# Altium schematic sheet AET_mcu.SchDoc
size 594 x 420 mm; SheetNumber: 1; SheetTotal: 1; SheetSize: А2
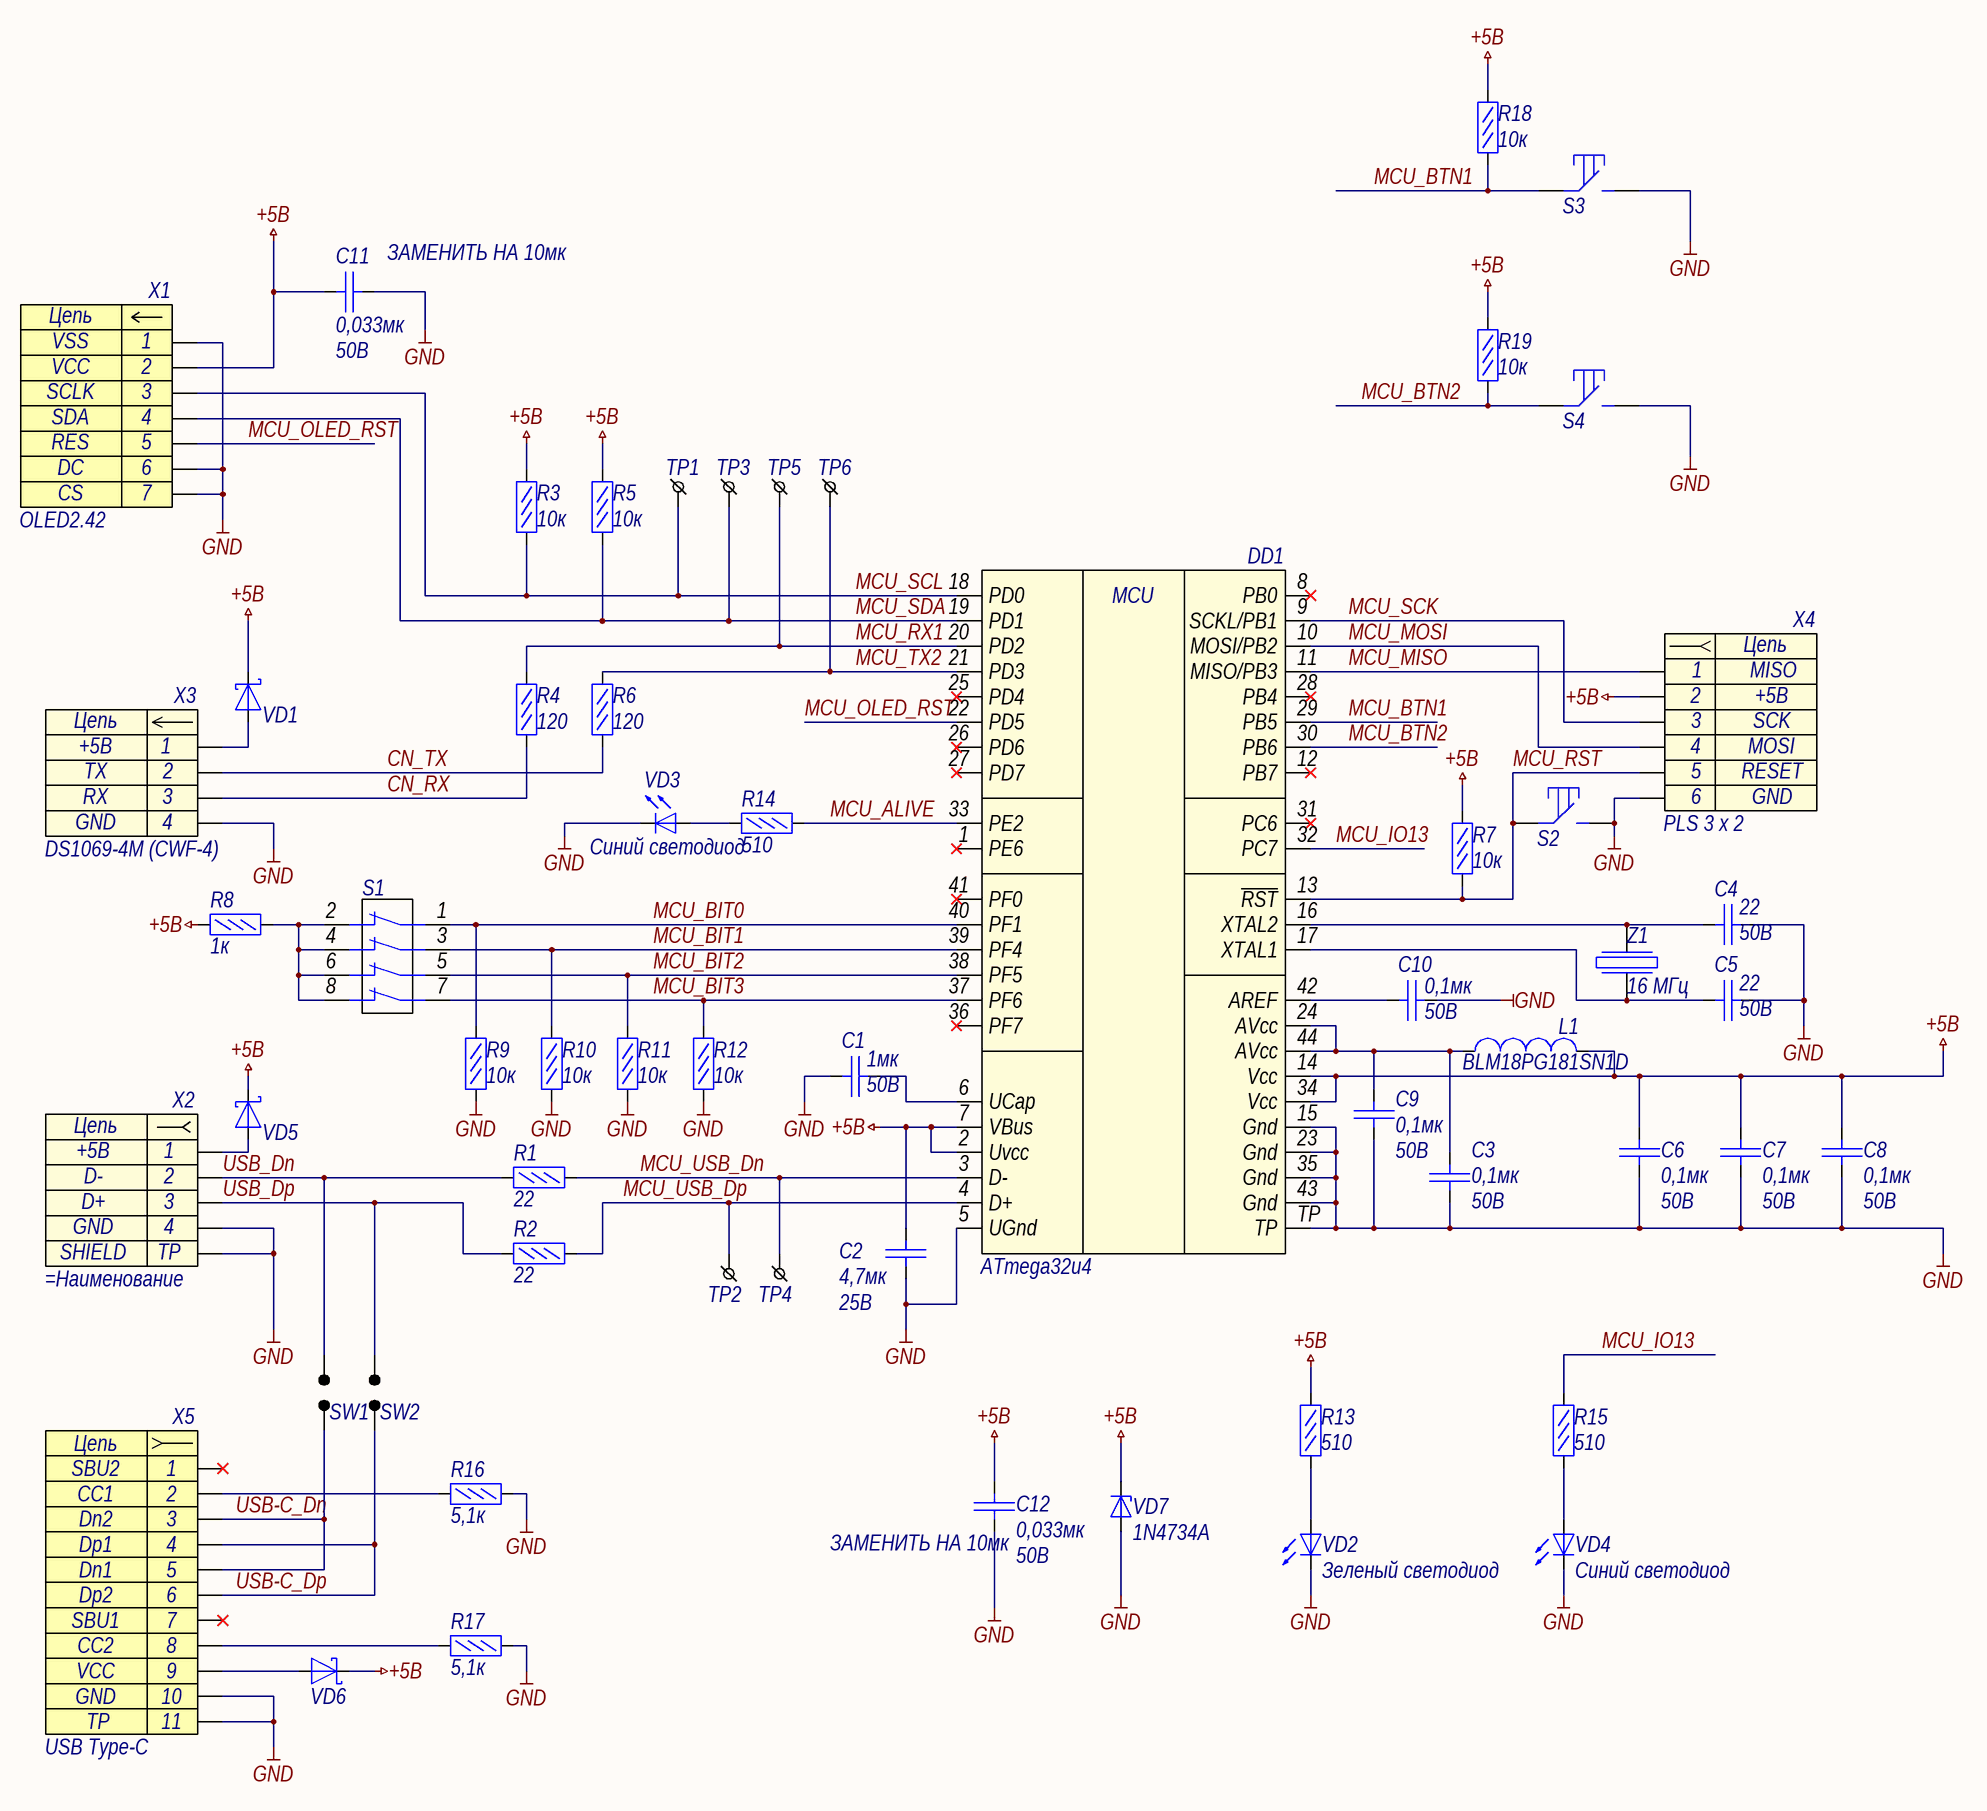
[diagram p0: AET_mcu.SchDoc]

## Parts
C1  Voltage: 50В  [C0603]  (hidden comment: 1мк)
C2  Voltage: 25В  [C0603]  (hidden comment: 4,7мк)
C3  Voltage: 50В  [C0603]  (hidden comment: 0,1мк)
C4  Voltage: 50В  [C0603]  (hidden comment: 22)
C5  Voltage: 50В  [C0603]  (hidden comment: 22)
C6  Voltage: 50В  [C0603]  (hidden comment: 0,1мк)
C7  Voltage: 50В  [C0603]  (hidden comment: 0,1мк)
C8  Voltage: 50В  [C0603]  (hidden comment: 0,1мк)
C9  Voltage: 50В  [C0603]  (hidden comment: 0,1мк)
C10  Voltage: 50В  [C0603]  (hidden comment: 0,1мк)
C11  Voltage: 50В  [C1206]  (hidden comment: 0,033мк)
C12  Voltage: 50В  [C1206]  (hidden comment: 0,033мк)
DD1  ATmega32u4  [UNIVERSAL_ATMEGA32U4]
L1  BLM18PG181SN1D  [L0603]
R1  22  [R0603]
R2  22  [R0603]
R3  10к  [R0603]
R4  120  [R0603]
R5  10к  [R0603]
R6  120  [R0603]
R7  10к  [R0603]
R8  1к  [R0603]
R9  10к  [R0603]
R10  10к  [R0603]
R11  10к  [R0603]
R12  10к  [R0603]
R13  510  [R0603]
R14  510  [R0603]
R15  510  [R0603]
R16  5,1к  [R0603]
R17  5,1к  [R0603]
R18  10к  [R0603]
R19  10к  [R0603]
S1  (no value)  [A6S-4102-H]
S2  IT-1187  [it-1187]  (value not drawn)
S3  IT-1198E  [IT-1198E]  (value not drawn)
S4  IT-1198E  [IT-1198E]  (value not drawn)
SW1  (no value)  [JUMPER_SOLDERED_3x1]
SW2  (no value)  [JUMPER_SOLDERED_3x1]
TP1  SCL  [TP_0,6X1]  (value not drawn)  (no BOM)
TP2  USB_Dp  [TP_0,6X1]  (value not drawn)  (no BOM)
TP3  SDA  [TP_0,6X1]  (value not drawn)  (no BOM)
TP4  USB_Dn  [TP_0,6X1]  (value not drawn)  (no BOM)
TP5  RX  [TP_0,6X1]  (value not drawn)  (no BOM)
TP6  TX  [TP_0,6X1]  (value not drawn)  (no BOM)
VD1  1N5817WS  [SOD323]  (value not drawn)
VD2  Зеленый светодиод  [VD0603]
VD3  Синий светодиод  [VD0603]
VD4  Синий светодиод  [VD0603]
VD5  1N5817WS  [SOD323]  (value not drawn)
VD6  1N5817WS  [SOD323]  (value not drawn)
VD7  1N4734A  [DO-41 Vertical]
X1  OLED2.42  [OLED2.42-PLS2.54-1x7]
X2  (no value)  [USB-A]
X3  DS1069-4M (CWF-4)  [CWF-4]
X4  PLS 3 x 2  [pls-2,54-3x2-tht-v]
X5  USB Type-C  [USB4105-15-A-120]
Z1  16 MГц  [QSMD3.2x2.5]

## Nets
+5В: C2.2 C6.2 C7.2 C8.2 C11.2 C12.1 DD1.2(Uvcc) DD1.7(VBus) DD1.14(Vcc) DD1.34(Vcc) L1.2 R3.2 R5.2 R7.2 R8.2 R13.2 R18.1 R19.1 VD1.1(K) VD5.1(K) VD6.1(K) VD7.2(K) X1.2 X4.2
GND: C1.1 C2.1 C3.1 C4.2 C5.2 C6.1 C7.1 C8.1 C9.1 C10.1 C11.1 C12.2 DD1.5(UGnd) DD1.15(Gnd) DD1.23(Gnd) DD1.35(Gnd) DD1.43(Gnd) DD1.TP R9.1 R10.1 R11.1 R12.1 R16.2 R17.2 S2.2 S3.2 S4.2 VD2.2(K) VD3.2(K) VD4.2(K) VD7.1(A) X1.1 X1.6 X1.7 X2.4 X2.TP X3.4 X4.6 X5.10(VCC) X5.TP
CN_RX: R4.1 X3.3
CN_TX: R6.1 X3.2
MCU_ALIVE: DD1.33(PE2) R14.1
MCU_BIT0: DD1.40(PF1) R9.2 S1.1
MCU_BIT1: DD1.39(PF4) R10.2 S1.3
MCU_BIT2: DD1.38(PF5) R11.2 S1.5
MCU_BIT3: DD1.37(PF6) R12.2 S1.7
MCU_BTN1: DD1.29(PB5) R18.2 S3.1
MCU_BTN2: DD1.30(PB6) R19.2 S4.1
MCU_IO13: DD1.32(PC7) R15.1
MCU_MISO: DD1.11(MISO/PB3) X4.1
MCU_MOSI: DD1.10(MOSI/PB2) X4.4
MCU_OLED_RST: DD1.22(PD5) X1.5
MCU_RST: DD1.13(~{RST}) R7.1 S2.1 X4.5
MCU_RX1: DD1.20(PD2) R4.2 TP5.1
MCU_SCK: DD1.9(SCKL/PB1) X4.3
MCU_SCL: DD1.18(PD0) R3.1 TP1.1 X1.3
MCU_SDA: DD1.19(PD1) R5.1 TP3.1 X1.4
MCU_TX2: DD1.21(PD3) R6.2 TP6.1
MCU_USB_Dn: DD1.3(D-) R1.2 TP4.1
MCU_USB_Dp: DD1.4(D+) R2.2 TP2.1
USB-C_Dn: SW1.1 X5.3(B7) X5.5(A7)
USB-C_Dp: SW2.1 X5.4(A6) X5.6(B6)
USB_Dn: R1.1 SW1.2 X2.2
USB_Dp: R2.1 SW2.2 X2.3
NetC1_2: C1.2 DD1.6(UCap)
NetC3_2: C3.2 C9.2 DD1.24(AVcc) DD1.44(AVcc) L1.1
NetC4_1: C4.1 DD1.16(XTAL2) Z1.2
NetC5_1: C5.1 DD1.17(XTAL1) Z1.1
NetC10_2: C10.2 DD1.42(AREF)
NetR8_1: R8.1 S1.2 S1.4 S1.6 S1.8
NetR13_1: R13.1 VD2.1(A)
NetR14_2: R14.2 VD3.1(A)
NetR15_2: R15.2 VD4.1(A)
NetR16_1: R16.1 X5.2(A5)
NetR17_1: R17.1 X5.8(B5)
NetVD1_2: VD1.2(A) X3.1
NetVD5_2: VD5.2(A) X2.1
NetVD6_2: VD6.2(A) X5.9(GND)

Not connected (* = marked no-connect by the designer): DD1 1(PE6)* 8(PB0)* 12(PB7)* 25(PD4)* 26(PD6)* 27(PD7)* 28(PB4)* 31(PC6)* 36(PF7)* 41(PF0)*; X5 1(B8)* 7(A8)*

## Notes on the sheet
- (near C11) ЗАМЕНИТЬ НА 10мк
- (near C12) ЗАМЕНИТЬ НА 10мк
- Перв. примен.
- Справ. №
- Подп. и дата
- Инв. № дубл.
- Взам. инв. №
- Изм.
- Лист
- № докум.
- Подп.
- Дата
- Лит.
- Масса
- Масштаб
- Т.контр.
- Пров.
- Разраб.
- Листов
- Инв. № подл.
- Н.контр.
- Файл:
- Утв.
- Копировал
- Формат
- (in symbol ATMEGA32U4) MCU
- (in symbol CWF-4) Цепь
- (in symbol HEADER-USB-2.0) Цепь; SHIELD
- (in symbol OLED2,42 - header) Цепь
- (in symbol PLS-3x2 ICSP) Цепь
- (in symbol USB4105-15-A-120) Цепь; 11

## Library data of the parts
C1 = CC0603KRX7R9BB105: Конденсатор кер. 1мкФ 50В; Manufacturer: Yageo; TKE: X7R; Name: CC0603KRX7R9BB105; Value: 1мк
C2 = CC0603KRX5R8BB475: Конденсатор кер. 4,7мкФ 25В; Manufacturer: Yageo; TKE: X7R; Name: CC0603KRX5R8BB475; Value: 4,7мк
C3 C6-C10 = CC0603JPX7R9BB104: Конденсатор кер. 0,1мкФ 50В; Manufacturer: Yageo; TKE: X7R; Name: CC0603JPX7R9BB104; Value: 0,1мк
C4 C5 = CC0603JRNPO9BN220: Конденсатор кер. 22пФ 50В; Manufacturer: Yageo; TKE: NP0; Name: CC0603JRNPO9BN220; Value: 22
C11 C12 = GRM3195C1H333J: Конденсатор кер. 0,033мкФ 50В NP0; Manufacturer: Murata; Name: GRM3195C1H333J; TKE: NP0; Value: 0,033мк
DD1 = ATMEGA32U4: Микроконтроллер AVR 8-bit; Name: ATmega32u4; HelpURL: https://files.amperka.ru/datasheets/ATMega32u4.pdf
L1 = BLM18PG181SN1D: Ферритовая бусина 180Ом 1,5А; Manufacturer: Murata; Name: BLM18PG181SN1D
R1 R2 = RC0603FR-0722RL: Резистор 22 Ом 0,1Вт 1%; Manufacturer: YAGEO; Name: RC0603FR-0722RL; Tolerance: 1%; Value: 22
R3 R5 R7 R9-R12 R18 R19 = RC0603FR-0710KL: Резистор 10кОм 0,063Вт 1%; Manufacturer: YAGEO; Name: RC0603FR-0710KL; Tolerance: 1%; Value: 10к
R4 R6 = RC0603FR-07120RL: Резистор 120Ом 0,063Вт 1%; Manufacturer: YAGEO; Name: RC0603FR-07120RL; Tolerance: 1%; Value: 120
R8 = RC0603FR-071KL: Резистор 1кОм 0,063Вт 1%; Manufacturer: YAGEO; Name: RC0603FR-071KL; Tolerance: 1%; Value: 1к
R13-R15 = RC0603FR-07510RL: Резистор 510 Ом 0,1Вт 1%; Manufacturer: YAGEO; Name: RC0603FR-07510RL; Tolerance: 1%; Value: 510
R16 R17 = RC0603FR-075K1L: Резистор 5,1кОм 0,1Вт 1%; Manufacturer: YAGEO; Name: RC0603FR-075K1L; Tolerance: 1%; Value: 5,1к
S1 = A6S-4102-H
S2 = IT-1187: тактовая кнопка SMD; Name: IT-1187
S3 S4 = IT-1198E: боковая тактовая кнопка SMD; Name: IT-1198E
SW1 SW2 = jumper: Запаиваемая перемычка
TP1-TP6 = TESTPOINT_HOLE
  TP1: Name: SCL
  TP2: Name: USB_Dp
  TP3: Name: SDA
  TP4: Name: USB_Dn
  TP5: Name: RX
  TP6: Name: TX
VD1 VD5 VD6 = 1N5817WS: Диод Шоттки 1N5817WS 20V 1А 0.45V; Производитель: Hottech Co. Ltd; current: 1A; voltage: 20В; drop voltage: 0,45В; Name: 1N5817WS
VD2 = FYLS-0603BUGC: Светодтод зеленый SMD Foryard Optoelectronics Co.; Name: Зеленый светодиод
VD3 VD4 = FYLS-0603BUBC: Светодтод синий SMD Foryard Optoelectronics Co.; Name: Синий светодиод
VD7 = 1N4734A: Стабилитрон 5.6В, 5%, 1Вт, 1N4734A; Voltage MAX: 5.88; Voltage MIN: 5.32; Name: 1N4734A; ComponentLink1Description: HelpURL; ComponentLink1URL: https://www.promelec.ru/fs/sources/54/98/aa/7a/f161d9308e45db5c55639eb6.pdf
X1 = OLED2,42 - header: OLED дисплей 2.42inc - PLS2.54 - 1x7; Contact_1: VSS; Contact_2: VCC; Contact_3: SCLK; Contact_4: SDA; Contact_5: RES; Contact_6: DC; Contact_7: CS; ClassName: *; Наименование: OLED2.42
X2 = HEADER-USB-2.0: Contact_1: +5В; Contact_2: D-; Contact_3: D+; Contact_4: GND
X3 = CWF-4: Разъем - 4 конт. прямая вилка на плату; Contact_1: +5В; Contact_2: TX; Contact_3: RX; Contact_4: GND; Name: DS1069-4M (CWF-4)
X4 = PLS-3x2 ICSP: Разъем - 6 конт. 2x3, шаг 2,54 мм; Contact_1: MISO; Contact_2: +5В; Contact_3: SCK; Contact_4: MOSI; Contact_5: RESET; Contact_6: GND; Name: PLS 3 x 2
X5 = USB4105-15-A-120: USB Type-C USB4105-GF-A / GCT; Contact_1: SBU2; Contact_2: CC1; Contact_3: Dn2; Contact_4: Dp1; Contact_5: Dn1; Contact_6: Dp2; Contact_7: SBU1; Contact_8: CC2; Contact_9: VCC; Contact_10: GND; Name: USB Type-C
Z1 = KX-7-16.0MHz: Кварцевый резонатор 16МГц; Partnumber: 12.88605; Name: KX-7-12.0MHz; Value: 16 MГц